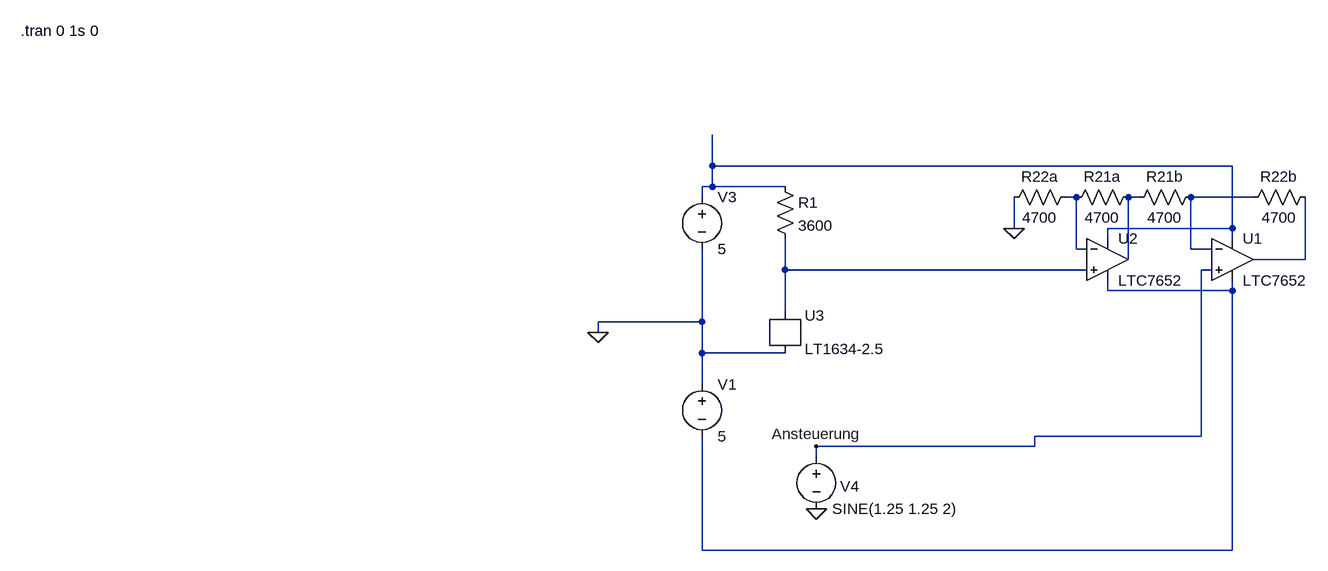
[diagram p0: schematic Subtractor-V0-1.asc]
Subtractor-V0-1.asc, the LTspice schematic file:
Version 4
SHEET 1 1604 792
WIRE 640 48 640 0
WIRE 1440 48 640 48
WIRE 640 80 640 48
WIRE 640 80 624 80
WIRE 752 80 640 80
WIRE 624 96 624 80
WIRE 1200 96 1184 96
WIRE 1296 96 1280 96
WIRE 1472 96 1376 96
WIRE 1104 144 1104 96
WIRE 1440 144 1440 48
WIRE 1440 144 1248 144
WIRE 1248 160 1248 144
WIRE 1440 160 1440 144
WIRE 1200 176 1200 96
WIRE 1216 176 1200 176
WIRE 1376 176 1376 96
WIRE 1408 176 1376 176
WIRE 1280 192 1280 96
WIRE 1552 192 1552 96
WIRE 1552 192 1472 192
WIRE 752 208 752 160
WIRE 1216 208 752 208
WIRE 1408 208 1392 208
WIRE 1248 240 1248 224
WIRE 1440 240 1440 224
WIRE 1440 240 1248 240
WIRE 752 272 752 208
WIRE 624 288 624 176
WIRE 624 288 464 288
WIRE 464 304 464 288
WIRE 624 336 624 288
WIRE 752 336 624 336
WIRE 624 384 624 336
WIRE 1392 464 1392 208
WIRE 1392 464 1136 464
WIRE 1136 480 1136 464
WIRE 1136 480 800 480
WIRE 800 496 800 480
WIRE 624 640 624 464
WIRE 1440 640 1440 240
WIRE 1440 640 624 640
FLAG 464 304 0
FLAG 800 576 0
FLAG 800 480 Ansteuerung
FLAG 1104 144 0
SYMBOL voltage 624 80 R0
WINDOW 123 0 0 Left 2
WINDOW 39 0 0 Left 2
SYMATTR InstName V3
SYMATTR Value 5
SYMBOL res 736 64 R0
SYMATTR InstName R1
SYMATTR Value 3600
SYMBOL Opamps\\LTC7652 1440 128 R0
SYMATTR InstName U1
SYMBOL voltage 800 480 R0
WINDOW 0 37 61 Left 2
WINDOW 123 24 124 Left 2
WINDOW 39 0 0 Left 2
SYMATTR InstName V4
SYMATTR Value SINE(1.25 1.25 2)
SYMBOL References\\LT1634-2.5 752 304 R0
SYMATTR InstName U3
SYMBOL Opamps\\LTC7652 1248 128 R0
SYMATTR InstName U2
SYMBOL res 1296 80 R90
WINDOW 0 0 56 VBottom 2
WINDOW 3 32 56 VTop 2
SYMATTR InstName R21a
SYMATTR Value 4700
SYMBOL res 1392 80 R90
WINDOW 0 0 56 VBottom 2
WINDOW 3 32 56 VTop 2
SYMATTR InstName R21b
SYMATTR Value 4700
SYMBOL res 1568 80 R90
WINDOW 0 0 56 VBottom 2
WINDOW 3 32 56 VTop 2
SYMATTR InstName R22b
SYMATTR Value 4700
SYMBOL res 1200 80 R90
WINDOW 0 0 56 VBottom 2
WINDOW 3 32 56 VTop 2
SYMATTR InstName R22a
SYMATTR Value 4700
SYMBOL voltage 624 368 R0
WINDOW 123 0 0 Left 2
WINDOW 39 0 0 Left 2
SYMATTR InstName V1
SYMATTR Value 5
TEXT -424 -160 Left 2 !.tran 0 1s 0

The netlist it stands for:
* Subtractor-V0-1.asc
V3 N001 0 5
R1 N001 N006 3600
XU1 Ansteuerung N004 N001 N007 N005 LTC1052  ; LTC7652, pins In+ In- V+ V- OUT
V4 Ansteuerung 0 SINE(1.25 1.25 2)
XU3 N006 0 LT1634-2.5
XU2 N006 N002 N001 N007 N003 LTC1052  ; LTC7652, pins In+ In- V+ V- OUT
R21a N003 N002 4700
R21b N004 N003 4700
R22b N005 N004 4700
R22a N002 0 4700
V1 0 N007 5
.tran 0 1s 0
.backanno
.end